# Altium schematic sheet MasterControlChip.SchDoc
size A3
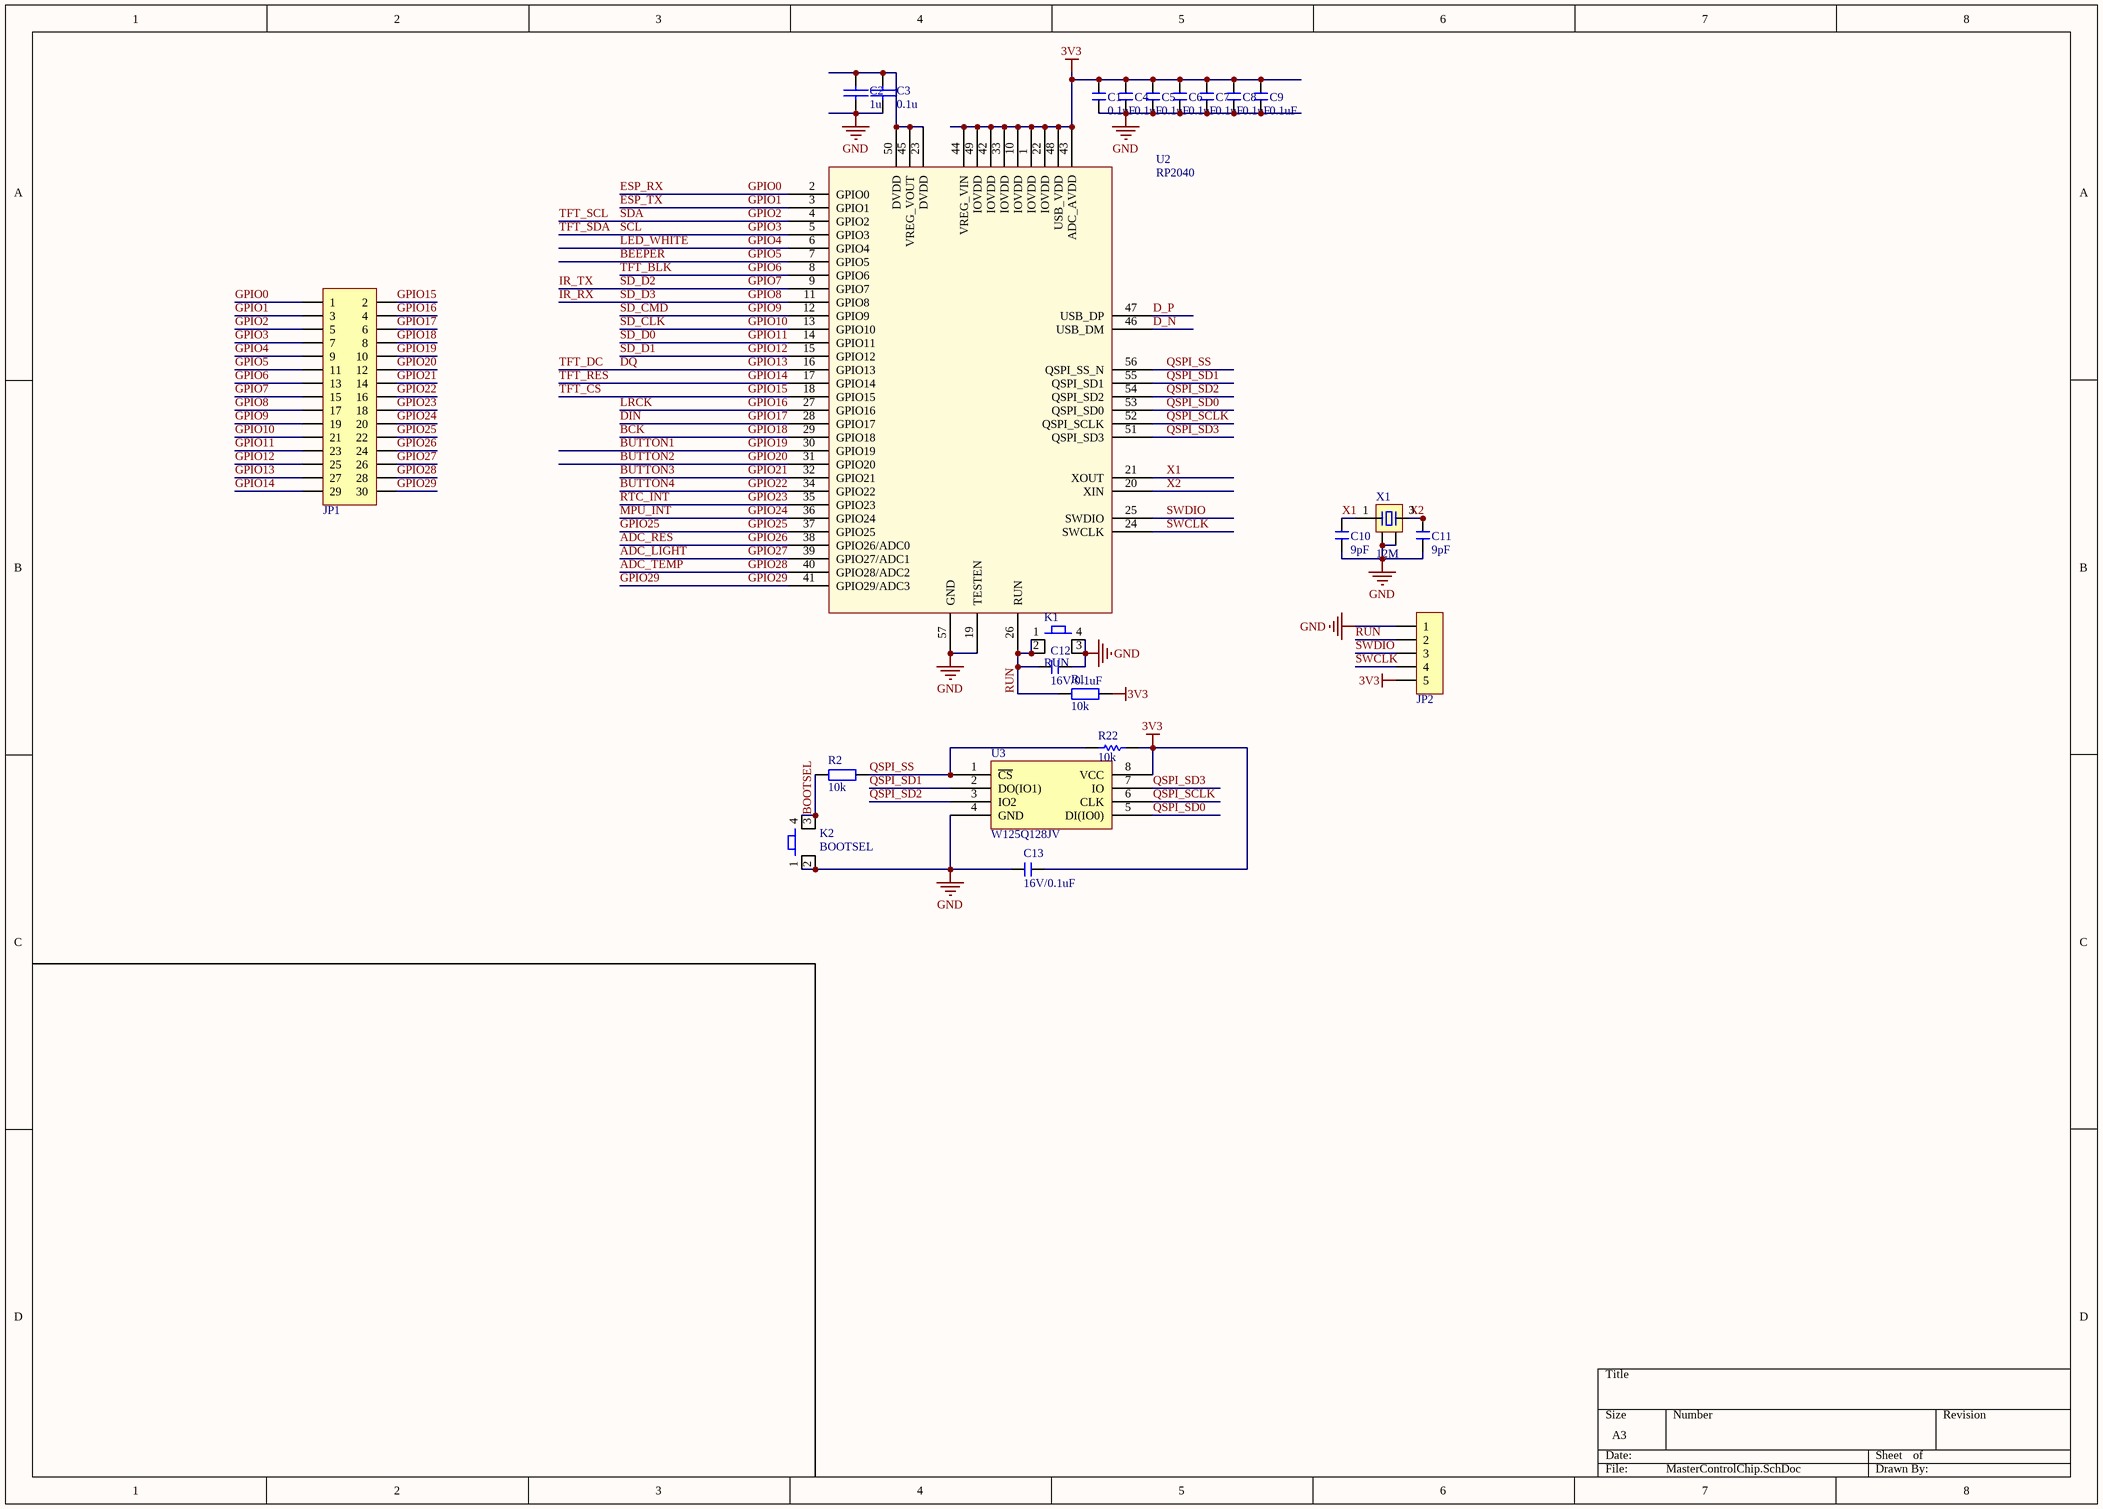
[diagram p0: MasterControlChip.SchDoc]

## Parts
C1  0.1uF  [C 0603_L]
C2  1u  [C 0603_L]
C3  0.1u  [C 0603_L]
C4  0.1uF  [C 0603_L]
C5  0.1uF  [C 0603_L]
C6  0.1uF  [C 0603_L]
C7  0.1uF  [C 0603_L]
C8  0.1uF  [C 0603_L]
C9  0.1uF  [C 0603_L]
C10  9pF  [C 0603_L]
C11  9pF  [C 0603_L]
C12  16V/0.1uF  [C 0603_L]
C13  16V/0.1uF  [C 0603_L]
JP1  Header 2X11  [HDR2.54-LI-2x15P]  (value not drawn)
JP2  HDR-1X5  [HDR2.54-M-LI-5P]  (value not drawn)
K1  RUN  [四角贴片开关]
K2  BOOTSEL  [四角贴片开关]
R1  10k  [R 0603_L]
R2  10k  [R 0603_L]
R22  10k  [0603R]
U2  RP2040  [QFN-56]
U3  W125Q128JV  [SOIC-8-208mil]
X1  12M  [OSC 3225-4P]

## Nets
3V3: C1.2 C4.2 C5.2 C6.2 C7.2 C8.2 C9.2 C13.1 JP2.5 R1.1 R22.2 U2.1(IOVDD) U2.10(IOVDD) U2.22(IOVDD) U2.33(IOVDD) U2.42(IOVDD) U2.43(ADC_AVDD) U2.44(VREG_VIN) U2.48(USB_VDD) U2.49(IOVDD) U3.8(VCC)
GND: C1.1 C2.1 C3.1 C4.1 C5.1 C6.1 C7.1 C8.1 C9.1 C10.1 C11.1 C12.1 C13.2 JP2.1 K1.3 K1.4 K2.1 K2.2 U2.19(TESTEN) U2.57(GND) U3.4(GND) X1.2 X1.4
ADC_LIGHT: JP1.26 U2.39(GPIO27/ADC1)  [also labelled GPIO27]
ADC_RES: JP1.24 U2.38(GPIO26/ADC0)  [also labelled GPIO26]
ADC_TEMP: JP1.28 U2.40(GPIO28/ADC2)  [also labelled GPIO28]
BCK: JP1.8 U2.29(GPIO18)  [also labelled GPIO18]
BEEPER: JP1.11 U2.7(GPIO5)  [also labelled GPIO5]
BOOTSEL: K2.3 K2.4 R2.2
BUTTON1: JP1.10 U2.30(GPIO19)  [also labelled GPIO19]
BUTTON2: JP1.12 U2.31(GPIO20)  [also labelled GPIO20]
BUTTON3: JP1.14 U2.32(GPIO21)  [also labelled GPIO21]
BUTTON4: JP1.16 U2.34(GPIO22)  [also labelled GPIO22]
D_N: U2.46(USB_DM)
D_P: U2.47(USB_DP)
DIN: JP1.6 U2.28(GPIO17)  [also labelled GPIO17]
DQ: JP1.27 U2.16(GPIO13)  [also labelled GPIO13, TFT_DC]
ESP_RX: JP1.1 U2.2(GPIO0)  [also labelled GPIO0]
ESP_TX: JP1.3 U2.3(GPIO1)  [also labelled GPIO1]
GPIO2: JP1.5 U2.4(GPIO2)  [also labelled SDA, TFT_SCL]
GPIO3: JP1.7 U2.5(GPIO3)  [also labelled SCL, TFT_SDA]
GPIO4: JP1.9 U2.6(GPIO4)  [also labelled LED_WHITE]
GPIO6: JP1.13 U2.8(GPIO6)  [also labelled TFT_BLK]
GPIO7: JP1.15 U2.9(GPIO7)  [also labelled IR_TX, SD_D2]
GPIO8: JP1.17 U2.11(GPIO8)  [also labelled IR_RX, SD_D3]
GPIO9: JP1.19 U2.12(GPIO9)  [also labelled SD_CMD]
GPIO10: JP1.21 U2.13(GPIO10)  [also labelled SD_CLK]
GPIO11: JP1.23 U2.14(GPIO11)  [also labelled SD_D0]
GPIO12: JP1.25 U2.15(GPIO12)  [also labelled SD_D1]
GPIO14: JP1.29 U2.17(GPIO14)  [also labelled TFT_RES]
GPIO15: JP1.2 U2.18(GPIO15)  [also labelled TFT_CS]
GPIO16: JP1.4 U2.27(GPIO16)  [also labelled LRCK]
GPIO23: JP1.18 U2.35(GPIO23)  [also labelled RTC_INT]
GPIO24: JP1.20 U2.36(GPIO24)  [also labelled MPU_INT]
GPIO25: JP1.22 U2.37(GPIO25)
GPIO29: JP1.30 U2.41(GPIO29/ADC3)
QSPI_SCLK: U2.52(QSPI_SCLK) U3.6(CLK)
QSPI_SD0: U2.53(QSPI_SD0) U3.5(DI(IO0))
QSPI_SD1: U2.55(QSPI_SD1) U3.2(DO(IO1))
QSPI_SD2: U2.54(QSPI_SD2) U3.3(IO2)
QSPI_SD3: U2.51(QSPI_SD3) U3.7(IO)
QSPI_SS: R2.1 R22.1 U2.56(QSPI_SS_N) U3.1(~{CS})
RUN: C12.2 JP2.2 K1.1 K1.2 R1.2 U2.26(RUN)
SWCLK: JP2.4 U2.24(SWCLK)
SWDIO: JP2.3 U2.25(SWDIO)
X1: C10.2 U2.21(XOUT) X1.1
X2: C11.2 U2.20(XIN) X1.3
NetC2_2: C2.2 C3.2 U2.23(DVDD) U2.45(VREG_VOUT) U2.50(DVDD)

## Library data of the parts
C1 C4-C13 = C: 无极性贴片电容; 版权归属: 源创客; 材质: X7R; BOM名称: 无极性贴片电容; 学习资源: www.ooocke.com
C2 = CAP: 靠近RP2040
C3 = CAP: 无极性电容
JP1 = Header 15X2: 15*2P接插件; 版权归属: 源创客; BOM名称: 15*2P接插件; 学习资源: www.ooocke.com
JP2 = Header 5: 5P接插件; 版权归属: 源创客; BOM名称: 5P接插件; 学习资源: www.ooocke.com
K1 K2 = 四角轻触开关
R1 R2 = R: 贴片电阻; 版权归属: 源创客; BOM名称: 贴片电阻; 学习资源: www.ooocke.com
R22 = RES
X1 = XTAL-4P: 4脚无源晶振